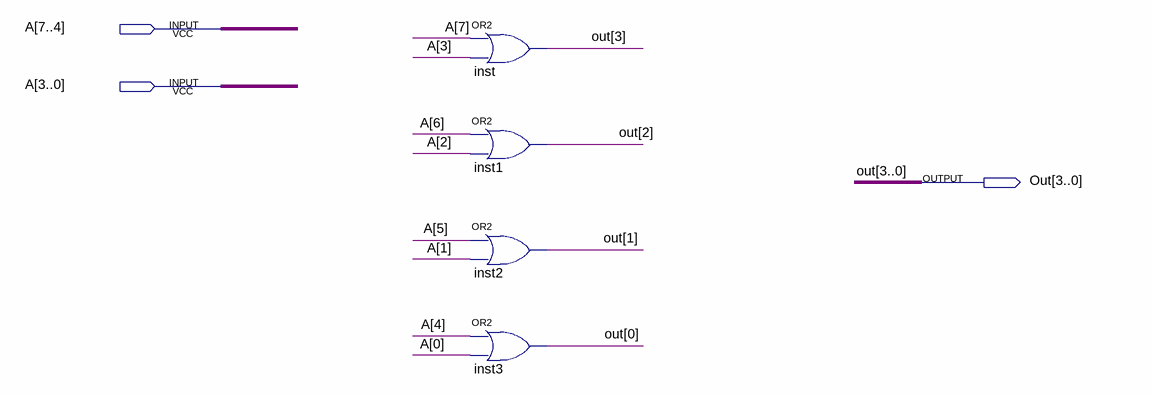
[diagram p0: schematic sheet]
// Quartus schematic bigOr.bdf as structural Verilog: 4 symbols, 3 pins
module bigOr (
  input  [7:0] A,
  output [3:0] Out
);

  or inst (Out[3], A[7], A[3]);
  or inst1 (Out[2], A[6], A[2]);
  or inst2 (Out[1], A[5], A[1]);
  or inst3 (Out[0], A[4], A[0]);
endmodule
